# EAGLE design LEDDriver (EAGLE 7.4.0)
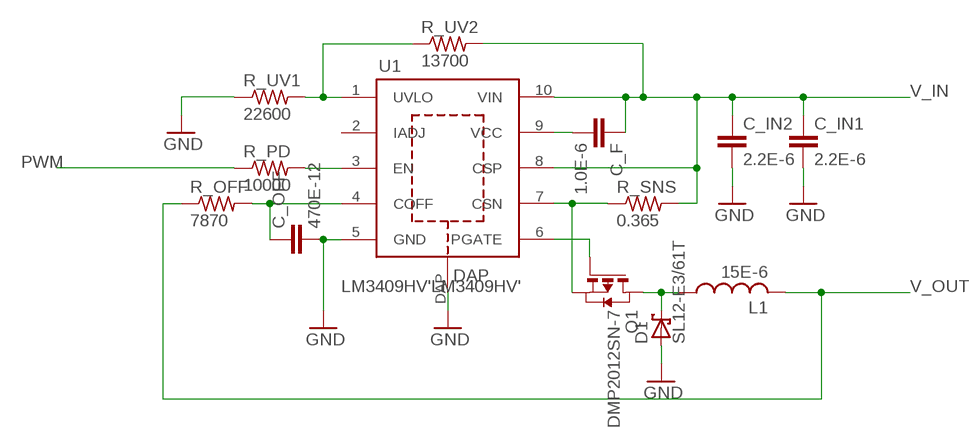
[diagram p0: schematic, sheet 1]

## Parts
C_F  1.0E-6  CC0603  [C0603]
C_IN1  2.2E-6  CC0603  [C0603]
C_IN2  2.2E-6  CC0603  [C0603]
C_OFF  470E-12  CC0402  [C0402]
D1  SL12-E3/61T  [SL12-E3/61T]
L1  15E-6  SRN8040  [SRN8040]
Q1  DMP2012SN-7  [DMP2012SN-7]
R_OFF  7870  R-US_R0603  [R0603]
R_PD  10000  R-US_R0603  [R0603]
R_SNS  0.365  R-US_R2512  [R2512]
R_UV1  22600  R-US_R0603  [R0603]
R_UV2  13700  R-US_R0603  [R0603]
U1  LM3409HV'LM3409HV'  [VSSOP-10]

## Nets
GND: C_IN1.2 C_IN2.2 C_OFF.2 D1.2(A) R_UV1.1 U1.5(GND) U1.DAP
L1: D1.1(C) L1.1 Q1.1(D)
N$1: C_F.2 U1.9(VCC)
N$2: R_UV1.2 R_UV2.1 U1.1(UVLO)
N$3: Q1.2(G) U1.6(PGATE)
N$5: R_PD.2 U1.3(EN)
N$6: C_OFF.1 R_OFF.2 U1.4(COFF)
N$8: Q1.3(S) R_SNS.1 U1.7(CSN)
PWM: R_PD.1
V_IN: C_F.1 C_IN1.1 C_IN2.1 R_SNS.2 R_UV2.2 U1.8(CSP) U1.10(VIN)
V_OUT: L1.2 R_OFF.1
Unconnected: U1.2(IADJ)

## Library data of the parts
C_F C_IN1 C_IN2 C_OFF = eagle-ltspice:C: CAPACITOR, European symbol; SPICEMODEL: NONE; SPICEPREFIX: C
D1 = DiscreteComponents:SL12-E3/61T
L1 = DiscreteComponents:SRN8040
Q1 = DiscreteComponents:DMP2012SN-7
R_OFF R_PD R_SNS R_UV1 R_UV2 = DiscreteComponents:R-US_: RESISTOR, American symbol
U1 = 2015_LED_Driver:LM3409HV

## Board
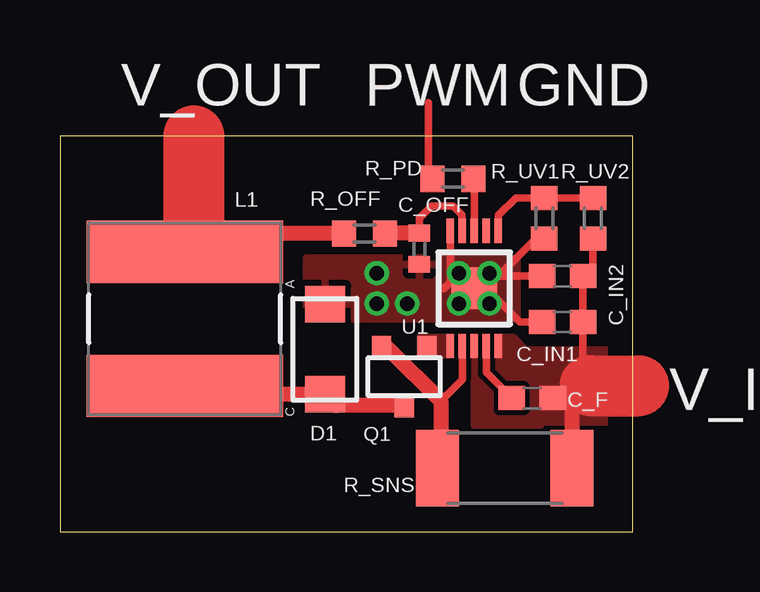
[diagram p1: board, top side]
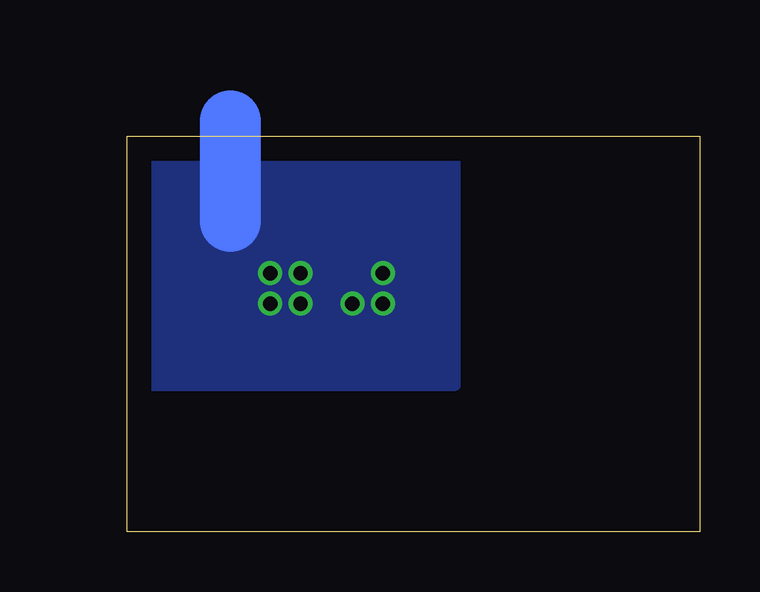
[diagram p2: board, bottom side, seen from below]

Size 23.88 x 16.51 mm. Coordinates in mm from the lower left corner, seen from the top.
Outline: 0,0 23.88,0 23.88,16.51 0,16.51 0,0
Copper layers (1*16): Top 0.035mm / dielectric 1.5mm / Bottom 0.035mm
Design rules "default": minimum track width 10mil, minimum drill 24mil, track to track 8mil, track to pad 8mil, pad to pad 8mil, via to via 8mil, smd to smd 8mil, copper to edge 40mil, drill to drill 8mil, minimum pad ring 10mil, minimum via ring 8mil, stop-mask expansion 4mil, vias tented up to drill 0mil, thermal gap 10mil

### Footprints (pad centres in the part's own frame; a part is rotated, then mirrored left to right if it is on the bottom)
C0603 = smd 1.1 x 1: 1 -0.85,0; 2 0.85,0
C0402 = smd 0.7 x 0.9: 1 -0.65,0; 2 0.65,0
SL12-E3/61T = smd 1.524 x 1.676: 1 -1.88,0; 2 1.88,0
SRN8040 = smd 2.6 x 8.2: 1 -2.8,0; 2 2.8,0
DMP2012SN-7 = smd 0.8 x 1: 1 0,1.2; 2 -0.95,-1.2; 3 0.95,-1.2
R0603 = smd 1 x 1.1: 1 -0.85,0; 2 0.85,0
R2512 = smd 1.8 x 3.2: 1 -2.8,0; 2 2.8,0
VSSOP-10 = smd 0.305 x 1.016: 1 -1.001,-2.4; 2 -0.5,-2.4; 3 0,-2.4; 4 0.5,-2.4; 5 1.001,-2.4; 6 1.001,2.4; 7 0.5,2.4; 8 0,2.4; 9 -0.5,2.4; 10 -1.001,2.4 | smd 1.905 x 1.727: DAP 0,0

### Placement (x,y rotation side)
C_F  19.68,5.59 180 top
C_IN1  20.95,8.76 180 top
C_IN2  20.95,10.67 180 top
C_OFF  14.99,11.81 270 top
D1  11.05,7.62 90 top
L1  5.21,8.89 90 top
Q1  14.35,6.48 180 top
R_OFF  12.7,12.45 0 top
R_PD  16.38,14.73 0 top
R_SNS  18.54,2.67 0 top
R_UV1  20.19,13.08 90 top
R_UV2  22.23,13.08 270 top
U1  17.27,10.16 180 top

### Tracks (layer width: path | path; a pad name or v marks a point on that pad's centre or on a via)
GND  (via drill 0.6)
  Top 0.305: U1.5 16.27,10.43 16,10.16 | R_UV1.1 19.85,12.23 18.29,10.67 | 17.78,10.16 U1.DAP | C_IN2.2 18.29,10.67 | 18.29,10.67 17.78,10.16 | C_IN1.2 19.18,8.76 17.78,10.16
  Top 0.406: 20.11,12.14 R_UV1.1
  Bottom 2.54: 19.56,12.95 19.56,17.14
  other vias: 16.64,10.79 17.91,10.79 16.64,9.53 17.91,9.53 13.21,10.79 13.21,9.53 14.48,9.53
  pour Bottom: 10.16,16 23.62,15.75 23.62,6.1 10.16,6.1
  pour Top: 10.29,11.43 19.05,11.43 19.05,8.89 10.29,8.89
  pour Top (no thermals): 15.88,11.43 18.67,11.43 18.67,8.89 15.88,8.89
L1
  Top 0.305: 11.28,6.35 D1.1
  Top 0.635: L1.1 5.56,5.74 D1.1 11.51,5.28 Q1.1
N$1
  Top 0.305: U1.9 17.77,6.65 C_F.2
N$2
  Top 0.305: R_UV2.1 R_UV1.2 19.01,13.93 18.29,13.21 18.29,12.58 U1.1
N$3
  pour Top (rank 2, no thermals): 16.26,8.13 14.99,8.13 14.99,7.37 16.26,7.37
N$5
  Top 0.254: 17.27,14.44 R_PD.2
  Top 0.305: 17.27,14.44 U1.3
N$6
  Top 0.305: C_OFF.1 14.99,13.08 15.49,13.59 16.38,13.59 16.76,13.21 U1.4
  Top 0.635: C_OFF.1 13.56,12.46 R_OFF.2
N$8
  Top 0.305: U1.7 16.77,6.36 15.88,5.46
  Top 0.635: Q1.3 13.66,7.68 15.88,5.46 15.88,2.8 R_SNS.1
N$15
  Top 0.305: 15.37,14.61 15.37,17.91
V_IN
  Top 0.305: R_UV2.2 22.23,11.09 C_IN2.1 C_IN1.1 21.8,6.9 21.84,6.86
  Top 0.406: C_IN1.1 21.84,8.76 | 21.84,6.86 22.1,6.86 22.1,6.1
  Top 0.635: C_F.1 21.21,5.59 21.34,5.46 R_SNS.2
  Top 2.54: 22.1,6.1 24.13,6.1
  pour Top (no thermals): 17.25,7.62 17.25,4.45 20.07,4.45 20.07,4.57 22.86,4.57 22.86,7.62 19.43,7.62 18.92,8.13 18.16,8.13 18.16,7.62
V_OUT
  Top 0.406: 5.59,11.68 5.21,15.49 | 5.59,11.69 L1.2 5.08,11.69 5.08,11.43
  Top 0.635: R_OFF.1 5.21,12.45 L1.2
  Top 2.54: 5.59,11.68 5.59,11.69 5.59,16.51

### Text on the board
tNames: V_OUT | PWM | GND | V_IN